# EasyEDA Pro project WorkshopEth.eprj

# Schematic WorkshopEth
Board Name: WorkshopEth; Create Date: 2024-12-09; Page Name: WorkshopEth; Project Name: WorkshopEth; Schematic Name: WorkshopEth; Update Date: 2024-12-20; Company: EasyEDA.com; Drawn: EasyEDA; Page Size: A4; Part Number: JLCPCB-002; Reviewed: EasyEDA; Version: V0.1
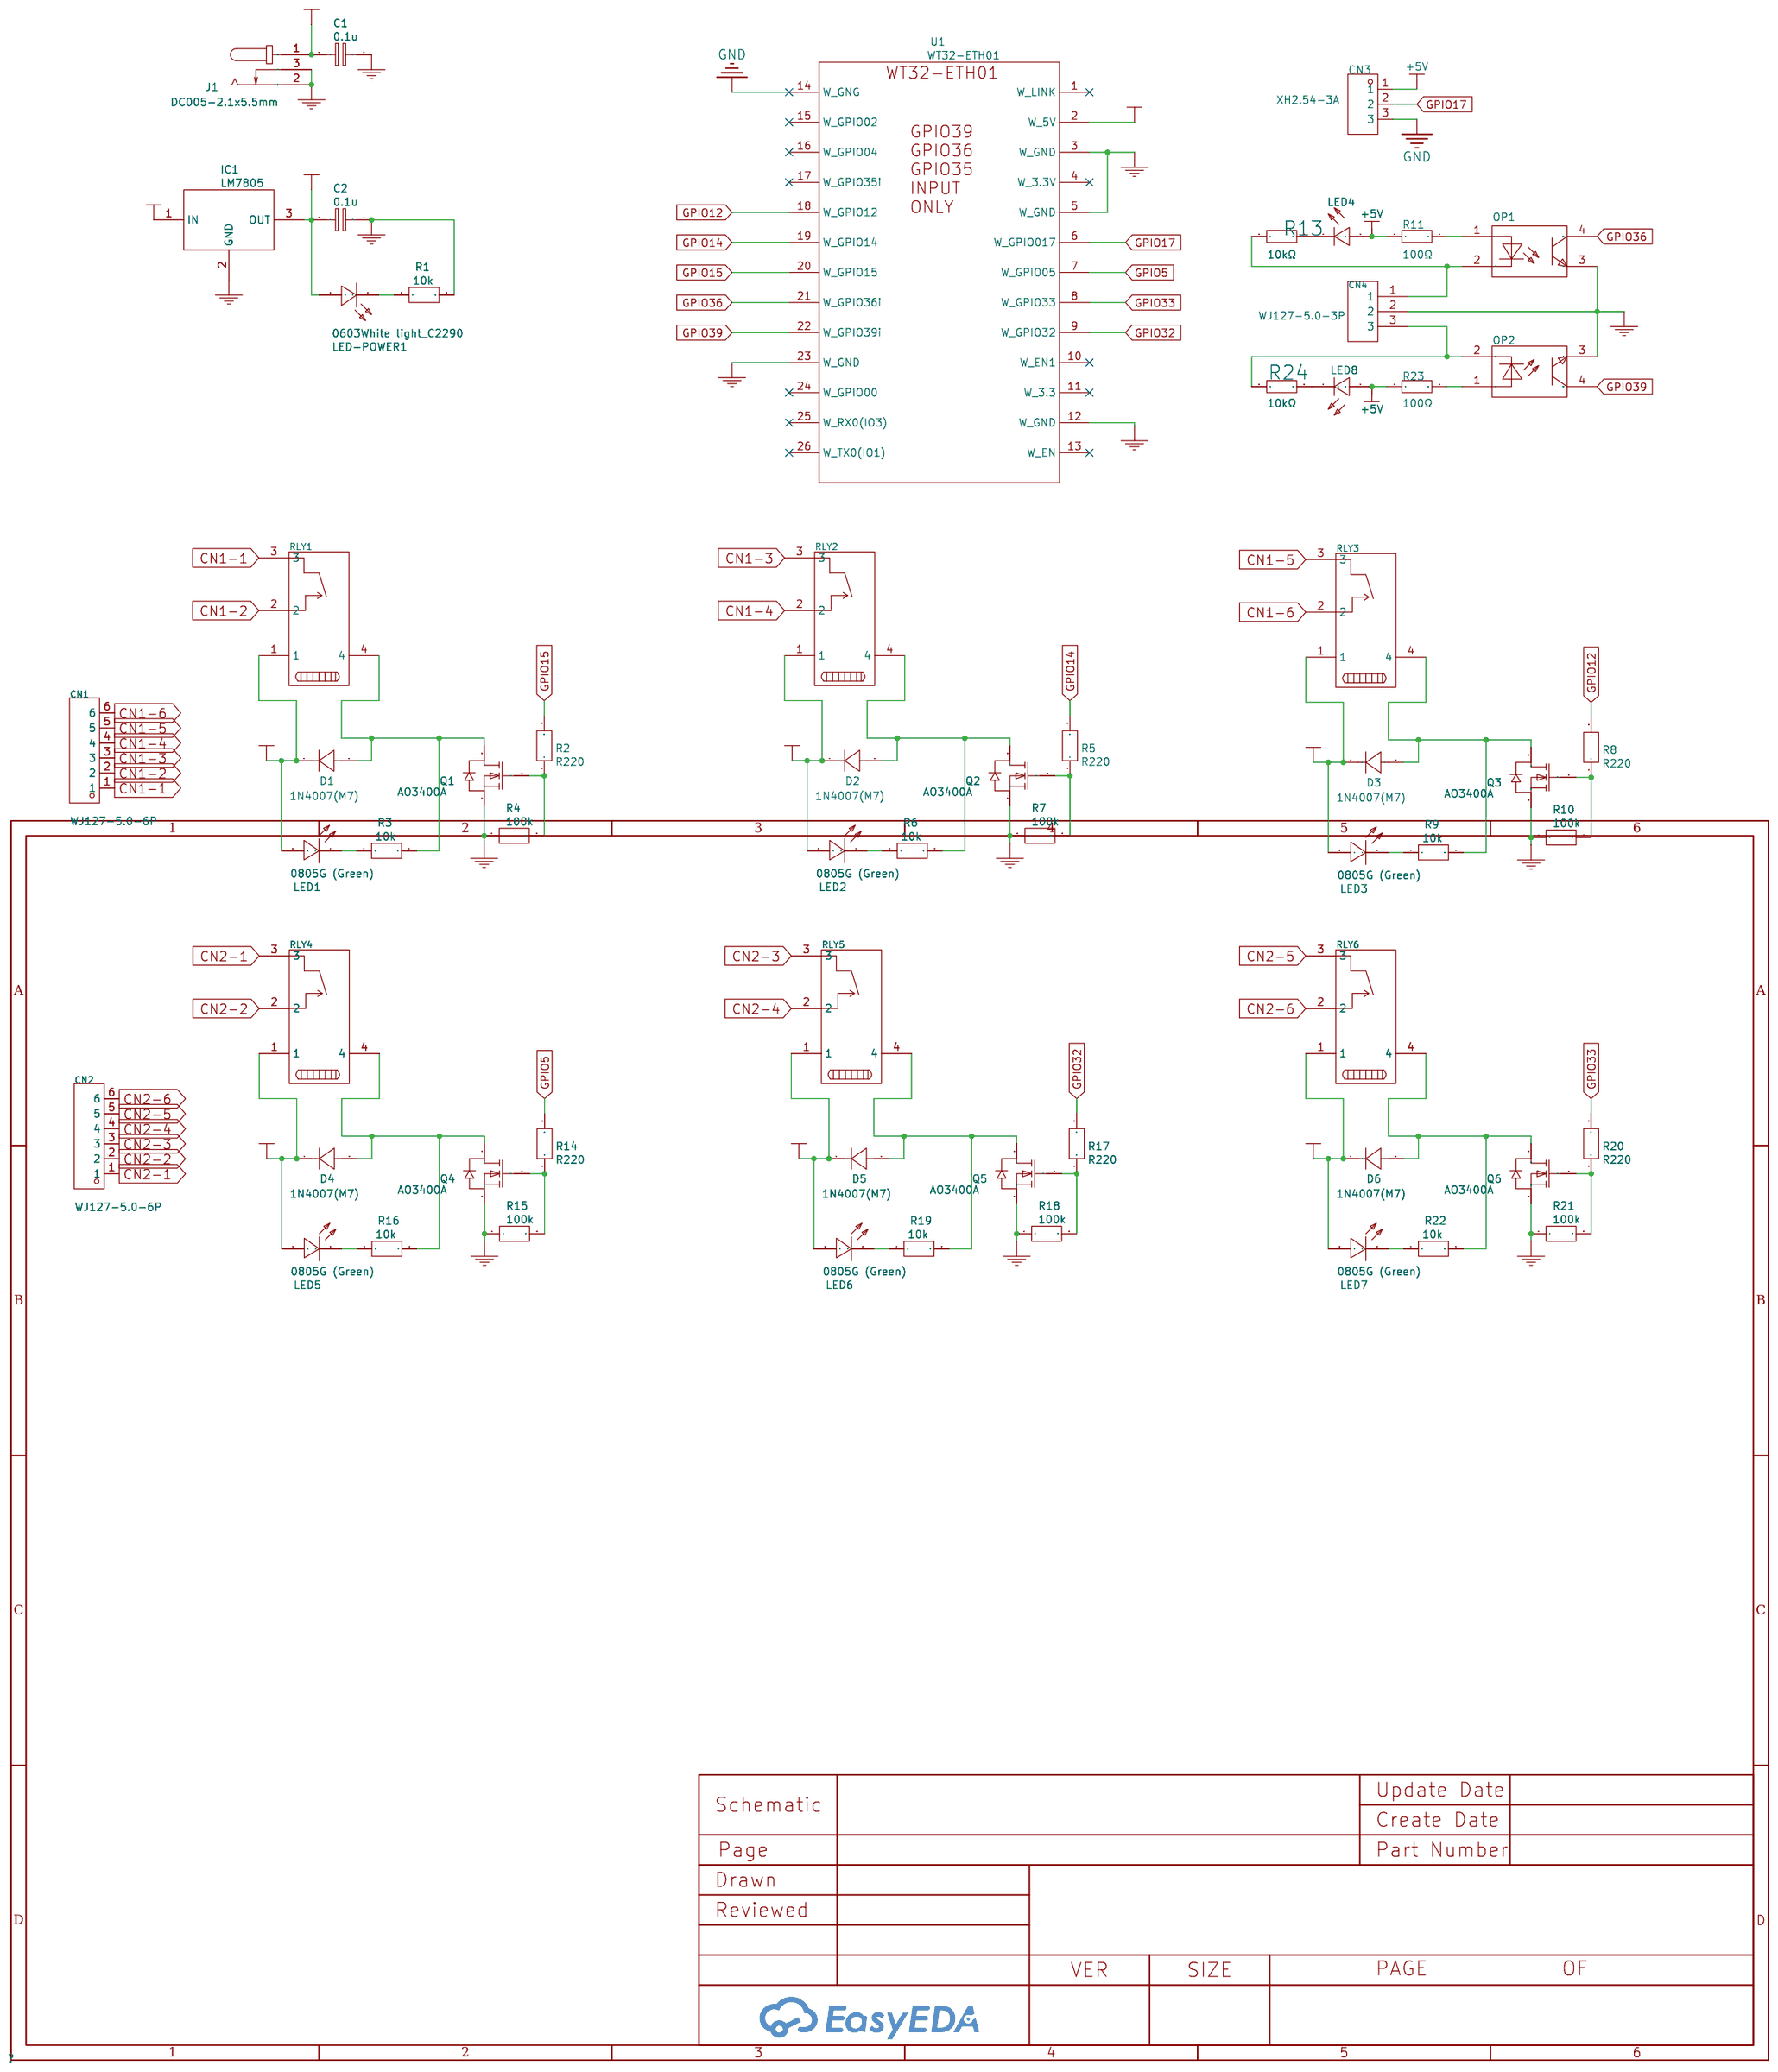
[diagram p0: schematic sheet]

## Parts
C1  0.1u  [C0603]
C2  0.1u  [C0603]
CN1  WJ127-5.0-6P  [CONN-TH_6P-P5.00_WJ127-5.0-6P]  (no BOM)
CN2  WJ127-5.0-6P  [CONN-TH_6P-P5.00_WJ127-5.0-6P]  (no BOM)
CN3  XH2.54-3A  [CONN-TH_3P-P2.50_HCTL_XH-3A-L]  (no BOM)
CN4  WJ127-5.0-3P  [CONN-TH_3P-P5.00_WJ127-5.0-3P]  (no BOM)
D1  1N4007(M7)  [SMA_L4.3-W2.7-LS5.1-RD]
D2  1N4007(M7)  [SMA_L4.3-W2.7-LS5.1-RD]
D3  1N4007(M7)  [SMA_L4.3-W2.7-LS5.1-RD]
D4  1N4007(M7)  [SMA_L4.3-W2.7-LS5.1-RD]
D5  1N4007(M7)  [SMA_L4.3-W2.7-LS5.1-RD]
D6  1N4007(M7)  [SMA_L4.3-W2.7-LS5.1-RD]
IC1  LM7805  [LM7805]  (no BOM)
J1  DC005-2.1x5.5mm  [DC-IN-TH_POWER-JACK]  (no BOM)
LED1  0805G (Green)  [LED0805-RD_GREEN]
LED2  0805G (Green)  [LED0805-RD_GREEN]
LED3  0805G (Green)  [LED0805-RD_GREEN]
LED4  19-213/Y2C-CQ2R2L/3T(CY)  [LED0603-RD-YELLOW]
LED5  0805G (Green)  [LED0805-RD_GREEN]
LED6  0805G (Green)  [LED0805-RD_GREEN]
LED7  0805G (Green)  [LED0805-RD_GREEN]
LED8  19-213/Y2C-CQ2R2L/3T(CY)  [LED0603-RD-YELLOW]
LED-POWER1  0603White light_C2290  [LED0603-R-RD_WHITE]
OP1  EL817S1(C)(TU)-F  [OPTO-SMD-4_L4.6-W6.5-P2.54-LS10.3-TL]
OP2  EL817S1(C)(TU)-F  [OPTO-SMD-4_L4.6-W6.5-P2.54-LS10.3-TL]
Q1  AO3400A  [SOT-23-3_L2.9-W1.6-P1.90-LS2.8-BR]
Q2  AO3400A  [SOT-23-3_L2.9-W1.6-P1.90-LS2.8-BR]
Q3  AO3400A  [SOT-23-3_L2.9-W1.6-P1.90-LS2.8-BR]
Q4  AO3400A  [SOT-23-3_L2.9-W1.6-P1.90-LS2.8-BR]
Q5  AO3400A  [SOT-23-3_L2.9-W1.6-P1.90-LS2.8-BR]
Q6  AO3400A  [SOT-23-3_L2.9-W1.6-P1.90-LS2.8-BR]
R1  10k  [R0603]
R2  R220  [R0603]
R3  10k  [R0603]
R4  100k  [R0603]
R5  R220  [R0603]
R6  10k  [R0603]
R7  100k  [R0603]
R8  R220  [R0603]
R9  10k  [R0603]
R10  100k  [R0603]
R11  100Ω  [R0805]
R13  10kΩ  [R0603]
R14  R220  [R0603]
R15  100k  [R0603]
R16  10k  [R0603]
R17  R220  [R0603]
R18  100k  [R0603]
R19  10k  [R0603]
R20  R220  [R0603]
R21  100k  [R0603]
R22  10k  [R0603]
R23  100Ω  [R0805]
R24  10kΩ  [R0603]
RLY1  G5NB-1A-E-DC5V  [RELAY-TH_G5NB-1A-E-DCXX]  (no BOM)
RLY2  G5NB-1A-E-DC5V  [RELAY-TH_G5NB-1A-E-DCXX]  (no BOM)
RLY3  G5NB-1A-E-DC5V  [RELAY-TH_G5NB-1A-E-DCXX]  (no BOM)
RLY4  G5NB-1A-E-DC5V  [RELAY-TH_G5NB-1A-E-DCXX]  (no BOM)
RLY5  G5NB-1A-E-DC5V  [RELAY-TH_G5NB-1A-E-DCXX]  (no BOM)
RLY6  G5NB-1A-E-DC5V  [RELAY-TH_G5NB-1A-E-DCXX]  (no BOM)
U1  WT32-ETH01  [WT32-ETH01-M]  (no BOM)

## Library data of the parts
C1 C2 = 0.1u: Supplier Part: C1525; Supplier: LCSC; Manufacturer Part: CL05B104KO5NNNC; Manufacturer: SAMSUNG(三星)
CN1 CN2 = WJ127-5.0-6P: LCSC Part Name: 5mm 1x6P 排数:1 每排P数:6 直插; Supplier Part: C192781; Manufacturer: KANGNEX(康奈克斯电气); Supplier Footprint: 插件,P=5mm; JLCPCB Part Class: Extended Part; Datasheet: https://atta.szlcsc.com/upload/public/pdf/source/20191225/C192781_B56A6C480C3F3CBA75DCAA22912D9BEF.pdf; Supplier: LCSC; Structure: 1x6P; Pitch: 5mm; Color: Green; Mounting Style: Straight; Current Rating (Max): 15A; Voltage Rating (Max): 250V; Number of Pins: 6P; Number of Rows: 1; Wire Gauge - AWG: 14~26; Wire Gauge - mm2: 1.5; Number of PINs Per Row: 6; Operating Temperature Range: -40℃~+105℃
CN3 = XH2.54-3A: Supplier Part: C9900018379; Supplier: LCSC
CN4 = WJ127-5.0-3P: LCSC Part Name: 5mm 1x3P 排数:1 每排P数:3 直插; Supplier Part: C8393; Manufacturer: KANGNEX(康奈克斯电气); Supplier Footprint: 插件,P=5mm; JLCPCB Part Class: Extended Part; Datasheet: https://atta.szlcsc.com/upload/public/pdf/source/20191225/C8393_D72692E3E43042C26B9E7345DD336F60.pdf; Supplier: LCSC; Structure: 1x3P; Pitch: 5mm; Color: Green; Mounting Style: Straight; Current Rating (Max): 15A; Voltage Rating (Max): 250V; Number of Pins: 3P; Number of Rows: 1; Wire Gauge - AWG: 14~26; Wire Gauge - mm2: 1.5; Number of PINs Per Row: 3; Operating Temperature Range: -40℃~+105℃
D1-D6 = 1N4007(M7): Supplier: LCSC; Supplier Part: C2988638; Manufacturer: UMW(友台半导体); JLCPCB Part Class: Extended Part
IC1 = LM7805: sim: true
J1 = DC005-2.1x5.5mm: Supplier: LCSC; Supplier Part: C9900001795; Manufacturer: 索峰; Manufacturer Part: POWER-JACK; JLCPCB Part Class: Extended Part
LED1-LED3 LED5-LED7 = 0805G (Green): Supplier: LCSC; Manufacturer: KENTO; Supplier Part: C2297; JLCPCB Part Class: Basic Part
LED4 LED8 = 19-213/Y2C-CQ2R2L/3T(CY): LCSC Part Name: 黄灯; Supplier Part: C72038; Manufacturer: EVERLIGHT(亿光); Supplier Footprint: 0603; JLCPCB Part Class: Basic Part; Datasheet: https://atta.szlcsc.com/upload/public/pdf/source/20160507/1462613613586.pdf; Supplier: LCSC; Emitted Color: Yellow; Power Dissipation: 60mW; Forward Current: 20mA; Dominant Wavelength: 585.5nm~591.5nm; Peak Wavelength: 591nm; Lens Color: 无色透明透镜; Viewing Angle: 120°; Operating Temperature: -40℃~+85℃
LED-POWER1 = 0603White light_C2290: Supplier: LCSC; Manufacturer: KENTO; Manufacturer Part: KT-0603W; Supplier Part: C2290; JLCPCB Part Class: Basic Part
OP1 OP2 = EL817S1(C)(TU)-F: Supplier: LCSC; Manufacturer: EVERLIGHT(亿光); Supplier Part: C106900; JLCPCB Part Class: Basic Part
Q1-Q6 = AO3400A: Supplier: LCSC; Manufacturer: AOS; Supplier Part: C20917; JLCPCB Part Class: Basic Part
R1 R3 R6 R9 R16 R19 R22 = 10k: Supplier Part: C25804; Supplier: LCSC; Manufacturer Part: 0603WAF1002T5E; Manufacturer: UNI-ROYAL(厚声)
R2 R5 R8 R14 R17 R20 = R220: Supplier Part: C22962; Supplier: LCSC; Manufacturer Part: 0603WAF2200T5E; Manufacturer: UNI-ROYAL(厚声)
R4 R7 R10 R15 R18 R21 = 100k: Supplier Part: C25803; Supplier: LCSC; Manufacturer Part: 0603WAF1003T5E; Manufacturer: UNI-ROYAL(厚声)
R11 R23 = 0805W8F1000T5E_C17408: LCSC Part Name: 100Ω ±1% 125mW 厚膜电阻; Supplier Part: C17408; Manufacturer: UNI-ROYAL(厚声); Manufacturer Part: 0805W8F1000T5E; Supplier Footprint: 0805; JLCPCB Part Class: Basic Part; Datasheet: https://atta.szlcsc.com/upload/public/pdf/source/20200306/C422600_1E6D84923E4A46A82E41ADD87F860B5C.pdf; Supplier: LCSC; Type: Thick Film Resistors; Tolerance: ±1%; Temperature Coefficient: ±100ppm/℃; Operating Temperature Range: -55℃~+155℃
R13 R24 = 0603WAF1002T5E: LCSC Part Name: 厚膜电阻 10kΩ ±1% 100mW; Supplier Part: C25804; Manufacturer: UNI-ROYAL(厚声); Supplier Footprint: 0603; JLCPCB Part Class: Basic Part; Datasheet: https://atta.szlcsc.com/upload/public/pdf/source/20200306/C422600_1E6D84923E4A46A82E41ADD87F860B5C.pdf; Supplier: LCSC; Type: Thick Film Resistors; Tolerance: ±1%; Temperature Coefficient: ±100ppm/℃; Operating Temperature Range: -55℃~+155℃
RLY1-RLY6 = G5NB-1A-E-DC5V: Supplier Part: C48746; Manufacturer: OMRON(欧姆龙); Supplier Footprint: 插件,7x20.4mm; JLCPCB Part Class: Extended Part; Supplier: LCSC
U1 = WT32-ETH01: Manufacturer: Wireless-Tag; link: http://www.wireless-tag.com/wp-content/uploads/2020/08/WT32-ETH01规格书V1.2EN（英文）.pdf

## Nets
+5V: C2.1 CN3.1 D1.1(K) D2.1(K) D3.1(K) D4.1(K) D5.1(K) D6.1(K) IC1.3(OUT) LED1.2(A) LED2.2(A) LED3.2(A) LED4.2(A) LED5.2(A) LED6.2(A) LED7.2(A) LED8.2(A) LED-POWER1.1(A) R11.1 R23.1 RLY1.1 RLY2.1 RLY3.1 RLY4.1 RLY5.1 RLY6.1 U1.2(W_5V)
GND: C1.2 C2.2 CN3.3 CN4.2 IC1.2(GND) J1.2(GND) J1.3 OP1.3(EM) OP2.3(EM) Q1.2(S) Q2.2(S) Q3.2(S) Q4.2(S) Q5.2(S) Q6.2(S) R1.2 R4.1 R7.1 R10.1 R15.1 R18.1 R21.1 U1.3(W_GND) U1.5(W_GND) U1.12(W_GND) U1.14(W_GNG) U1.23(W_GND)
VCC: C1.1 IC1.1(IN) J1.1(VCC)
CN1-1: CN1.1 RLY1.3
CN1-2: CN1.2 RLY1.2
CN1-3: CN1.3 RLY2.3
CN1-4: CN1.4 RLY2.2
CN1-5: CN1.5 RLY3.3
CN1-6: CN1.6 RLY3.2
CN2-1: CN2.1 RLY4.3
CN2-2: CN2.2 RLY4.2
CN2-3: CN2.3 RLY5.3
CN2-4: CN2.4 RLY5.2
CN2-5: CN2.5 RLY6.3
CN2-6: CN2.6 RLY6.2
GPIO5: R14.2 U1.7(W_GPIO05)
GPIO12: R8.2 U1.18(W_GPIO12)
GPIO14: R5.2 U1.19(W_GPIO14)
GPIO15: R2.2 U1.20(W_GPIO15)
GPIO17: CN3.2 U1.6(W_GPIO017)
GPIO32: R17.2 U1.9(W_GPIO32)
GPIO33: R20.2 U1.8(W_GPIO33)
GPIO36: OP1.4(COL) U1.21(W_GPIO36i)
GPIO39: OP2.4(COL) U1.22(W_GPIO39i)
$1N3: D1.2(A) Q1.3(D) R3.2 RLY1.4
$1N5: Q1.1(G) R2.1 R4.2
$1N15: LED1.1(K) R3.1
$1N16: LED-POWER1.2(K) R1.1
$1N14239: D2.2(A) Q2.3(D) R6.2 RLY2.4
$1N14251: LED2.1(K) R6.1
$1N14257: Q2.1(G) R5.1 R7.2
$1N14805: D3.2(A) Q3.3(D) R9.2 RLY3.4
$1N14817: LED3.1(K) R9.1
$1N14823: Q3.1(G) R8.1 R10.2
$1N15278: OP1.1(AN) R11.2
$1N15297: CN4.1 OP1.2(CAT) R13.1
$1N21025: LED4.1(C) R13.2
$1N23793: D4.2(A) Q4.3(D) R16.2 RLY4.4
$1N23794: Q4.1(G) R14.1 R15.2
$1N23798: LED5.1(K) R16.1
$1N24302: D5.2(A) Q5.3(D) R19.2 RLY5.4
$1N24303: Q5.1(G) R17.1 R18.2
$1N24307: LED6.1(K) R19.1
$1N24310: D6.2(A) Q6.3(D) R22.2 RLY6.4
$1N24311: Q6.1(G) R20.1 R21.2
$1N24315: LED7.1(K) R22.1
$1N26257: OP2.1(AN) R23.2
$1N26258: CN4.3 OP2.2(CAT) R24.1
$1N26259: LED8.1(C) R24.2

Not connected (* = marked no-connect by the designer): U1 1(W_LINK)* 4(W_3.3V)* 10(W_EN1)* 11(W_3.3)* 13(W_EN)* 15(W_GPIO02)* 16(W_GPIO04)* 17(W_GPIO35i)* 24(W_GPIO00)* 25(W_RX0(IO3))* 26(W_TX0(IO1))*

# Board WorkshopEth
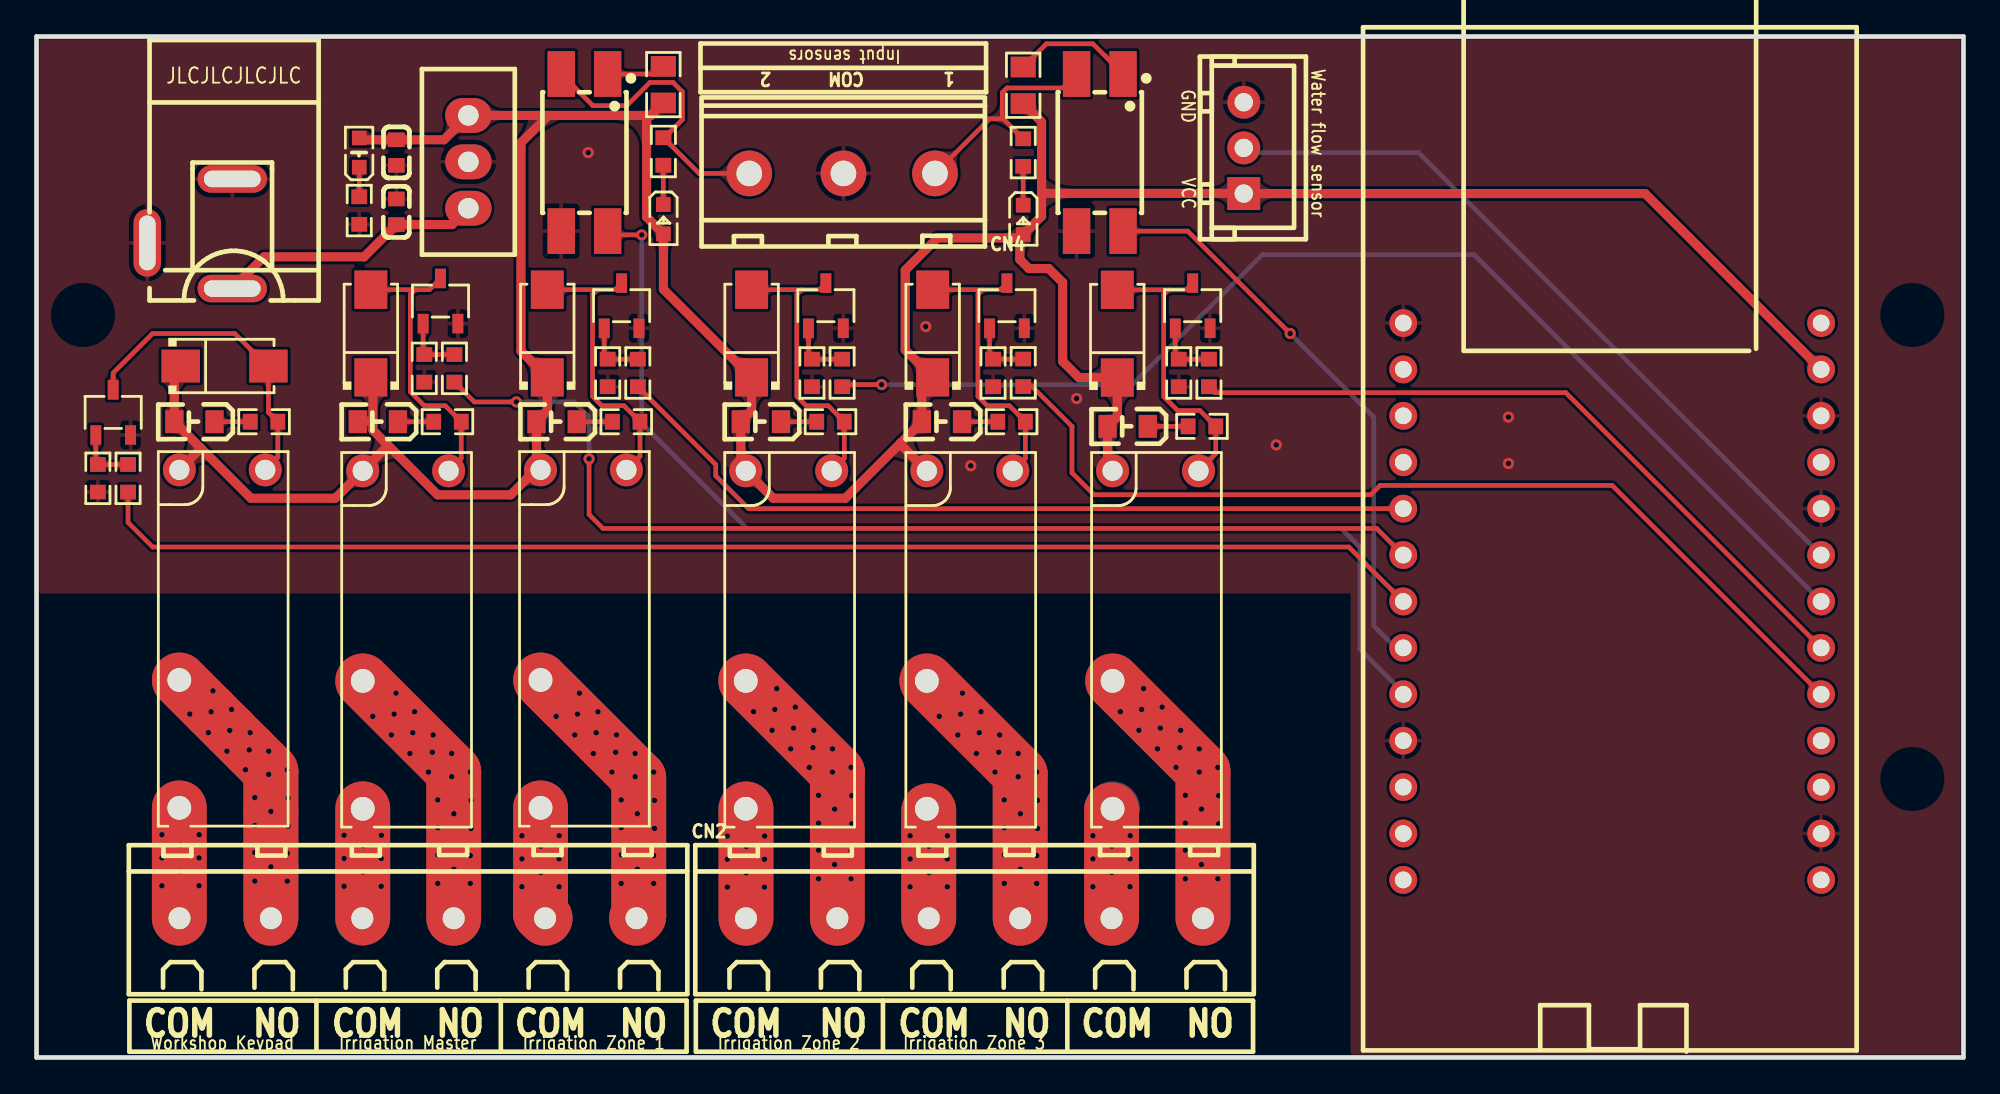
[diagram p1: board, top side]
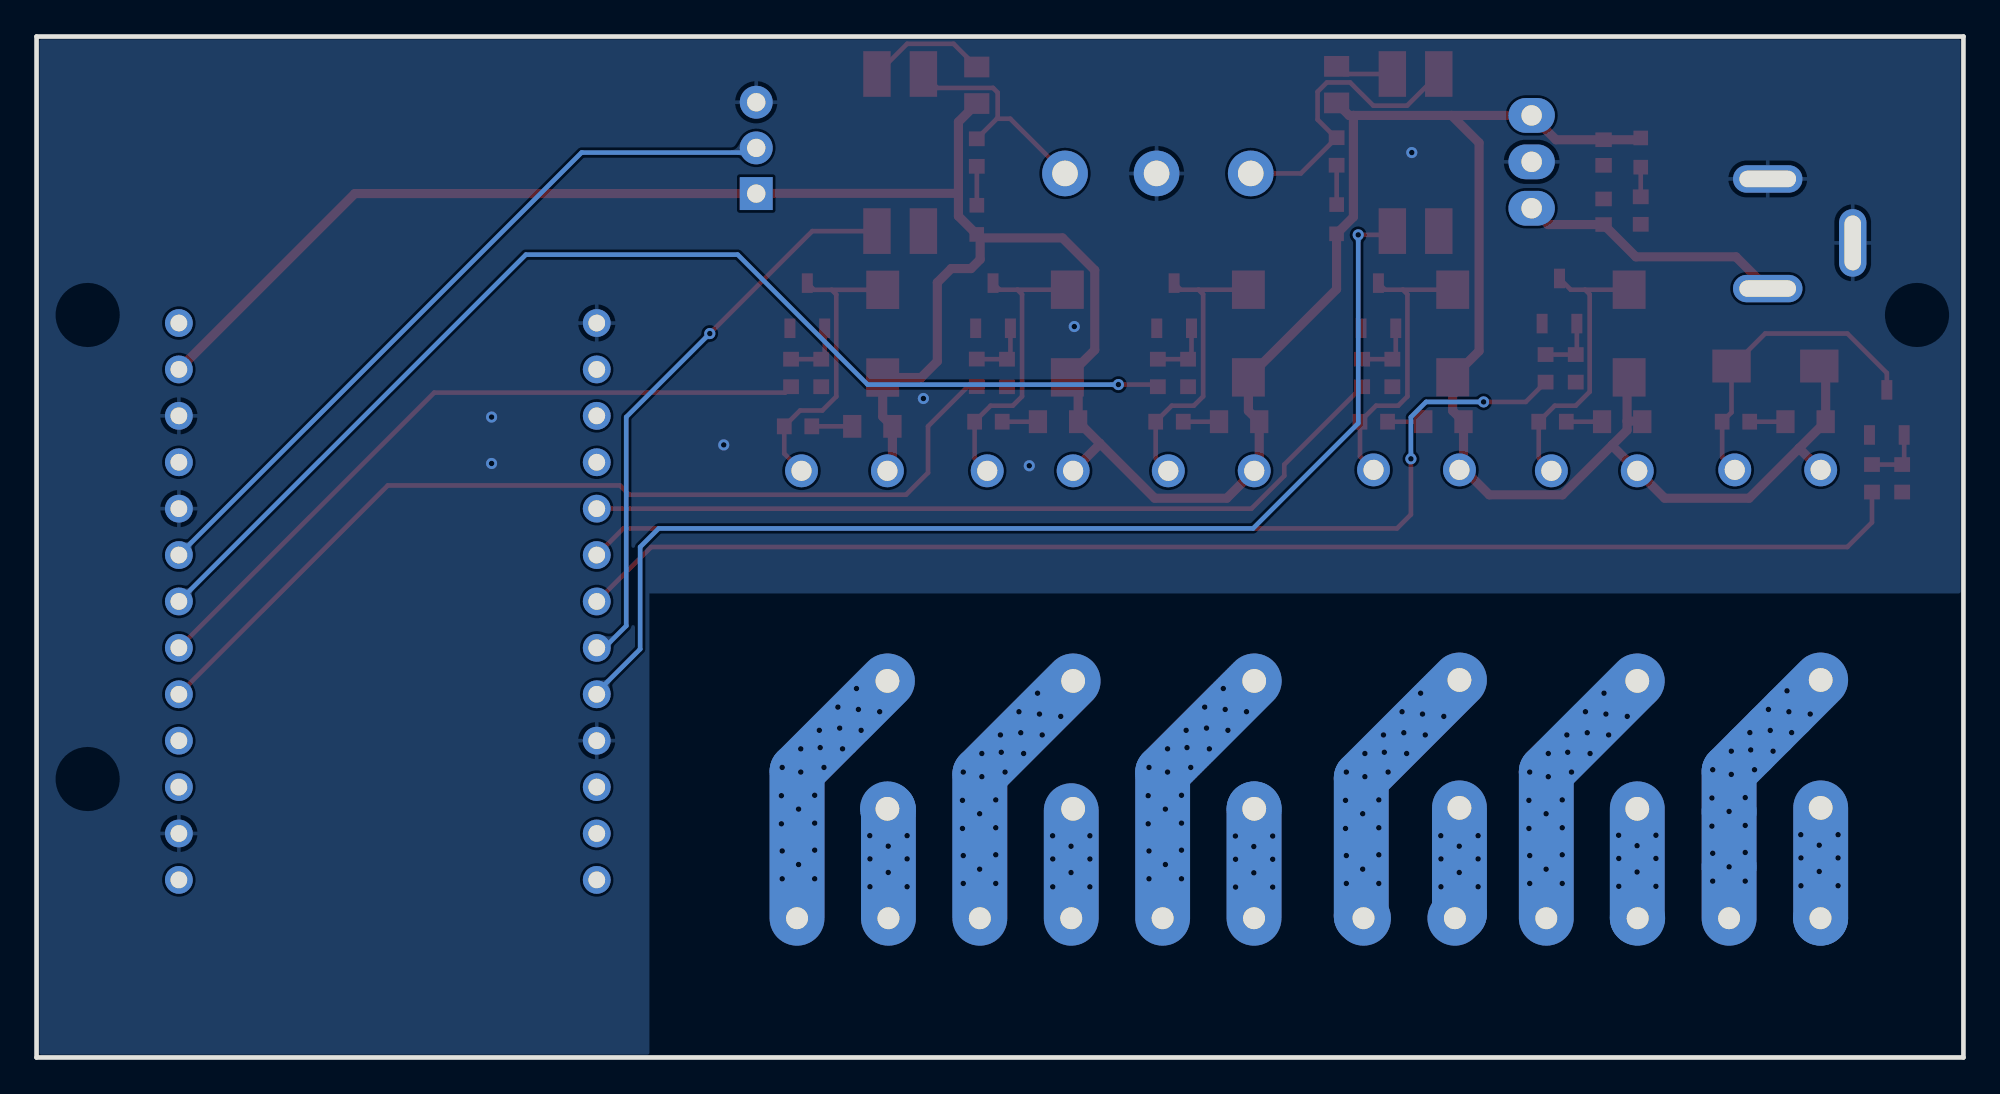
[diagram p2: board, bottom side, seen from below]

Outline 105.41 x 55.88 mm; copper layers: Top Layer, Bottom Layer. Coordinates in mm from the lower left corner of the outline.
Outline path: 0,55.88 105.41,55.88 105.41,0 0,0 0,55.88
Stack: Top Layer 0.035mm / Dielectric1 1.51mm FR4 er 4.5 / Bottom Layer 0.035mm

## Design rules (mm)
template: User Custom Config
spacing Default (default): track to track 0.152, other pairs 0 to 0.152
track width Default (default): min 0.254, default 0.254, max 25.4
track width 0.5mm: min 0.5, default 0.5, max 2.54
differential pair differentialPair (default): width min 0.127, default 0.254, max 2.54; gap min 0.152, default 0.152
via Default (default): diameter min 0.61, default 0.61, max 100.025; hole min 0.305, default 0.305, max 59.995
net +5V uses 0.5mm
net VCC uses 0.5mm

## Placement (name value [footprint] x y rotation side)
C1  0.1u  [C0603]  19.69 46.29 90 top
C2  0.1u  [C0603]  19.69 49.53 270 top
CN1  WJ127-5.0-6P  [CONN-TH_6P-P5.00_WJ127-5.0-6P]  20.32 7.62 0 top
CN2  WJ127-5.0-6P  [CONN-TH_6P-P5.00_WJ127-5.0-6P]  51.31 7.62 0 top
CN3  XH2.54-3A  [CONN-TH_3P-P2.50_HCTL_XH-3A-L]  66.04 49.78 270 top
CN4  WJ127-5.0-3P  [CONN-TH_3P-P5.00_WJ127-5.0-3P]  44.07 48.39 180 top
D1  1N4007(M7)  [SMA_L4.3-W2.7-LS5.1-RD]  10.29 37.85 0 top
D2  1N4007(M7)  [SMA_L4.3-W2.7-LS5.1-RD]  18.29 39.62 90 top
D3  1N4007(M7)  [SMA_L4.3-W2.7-LS5.1-RD]  27.94 39.62 90 top
D4  1N4007(M7)  [SMA_L4.3-W2.7-LS5.1-RD]  39.12 39.62 90 top
D5  1N4007(M7)  [SMA_L4.3-W2.7-LS5.1-RD]  49.02 39.62 90 top
D6  1N4007(M7)  [SMA_L4.3-W2.7-LS5.1-RD]  59.12 39.62 90 top
IC1  -  [LM7805]  23.62 49.02 90 top
J1  DC005-2.1x5.5mm  [DC-IN-TH_POWER-JACK]  8.38 45.08 270 top
LED1  0805G (Green)  [LED0805-RD_GREEN]  8.64 34.8 0 top
LED2  0805G (Green)  [LED0805-RD_GREEN]  18.67 34.8 0 top
LED3  0805G (Green)  [LED0805-RD_GREEN]  28.45 34.8 0 top
LED4  19-213/Y2C-CQ2R2L/3T(CY)  [LED0603-RD-YELLOW]  53.97 45.85 270 top
LED5  0805G (Green)  [LED0805-RD_GREEN]  39.62 34.8 0 top
LED6  0805G (Green)  [LED0805-RD_GREEN]  49.53 34.8 0 top
LED7  0805G (Green)  [LED0805-RD_GREEN]  59.69 34.54 0 top
LED8  19-213/Y2C-CQ2R2L/3T(CY)  [LED0603-RD-YELLOW]  34.29 45.88 270 top
LED-POWER1  0603White light_C2290  [LED0603-R-RD_WHITE]  17.65 49.53 90 top
OP1  EL817S1(C)(TU)-F  [OPTO-SMD-4_L4.6-W6.5-P2.54-LS10.3-TL]  58.17 49.53 270 top
OP2  EL817S1(C)(TU)-F  [OPTO-SMD-4_L4.6-W6.5-P2.54-LS10.3-TL]  29.97 49.53 270 top
Q1  AO3400A  [SOT-23-3_L2.9-W1.6-P1.90-LS2.8-BR]  4.19 35.31 90 top
Q2  AO3400A  [SOT-23-3_L2.9-W1.6-P1.90-LS2.8-BR]  22.1 41.4 90 top
Q3  AO3400A  [SOT-23-3_L2.9-W1.6-P1.90-LS2.8-BR]  32 41.15 90 top
Q4  AO3400A  [SOT-23-3_L2.9-W1.6-P1.90-LS2.8-BR]  43.18 41.15 90 top
Q5  AO3400A  [SOT-23-3_L2.9-W1.6-P1.90-LS2.8-BR]  53.09 41.15 90 top
Q6  AO3400A  [SOT-23-3_L2.9-W1.6-P1.90-LS2.8-BR]  63.25 41.15 90 top
R1  10k  [R0603]  17.65 46.36 270 top
R2  R220  [R0603]  5 31.7 270 top
R3  10k  [R0603]  12.45 34.8 0 top
R4  100k  [R0603]  3.35 31.7 90 top
R5  R220  [R0603]  22.86 37.72 270 top
R6  10k  [R0603]  22.48 34.8 0 top
R7  100k  [R0603]  21.21 37.72 90 top
R8  R220  [R0603]  32.89 37.47 270 top
R9  10k  [R0603]  32.26 34.8 0 top
R10  100k  [R0603]  31.24 37.47 90 top
R11  100Ω  [R0805]  53.97 53.21 90 top
R13  10kΩ  [R0603]  53.97 49.53 270 top
R14  R220  [R0603]  44.07 37.47 270 top
R15  100k  [R0603]  42.42 37.47 90 top
R16  10k  [R0603]  43.43 34.8 0 top
R17  R220  [R0603]  53.97 37.47 270 top
R18  100k  [R0603]  52.32 37.47 90 top
R19  10k  [R0603]  53.34 34.8 0 top
R20  R220  [R0603]  64.13 37.47 270 top
R21  100k  [R0603]  62.48 37.47 90 top
R22  10k  [R0603]  63.75 34.54 0 top
R23  100Ω  [R0805]  34.29 53.25 90 top
R24  10kΩ  [R0603]  34.29 49.59 270 top
RLY1  G5NB-1A-E-DC5V  [RELAY-TH_G5NB-1A-E-DCXX]  10.16 22.91 270 top
RLY2  G5NB-1A-E-DC5V  [RELAY-TH_G5NB-1A-E-DCXX]  20.19 22.86 270 top
RLY3  G5NB-1A-E-DC5V  [RELAY-TH_G5NB-1A-E-DCXX]  29.92 22.91 270 top
RLY4  G5NB-1A-E-DC5V  [RELAY-TH_G5NB-1A-E-DCXX]  41.15 22.86 270 top
RLY5  G5NB-1A-E-DC5V  [RELAY-TH_G5NB-1A-E-DCXX]  51.05 22.86 270 top
RLY6  G5NB-1A-E-DC5V  [RELAY-TH_G5NB-1A-E-DCXX]  61.21 22.86 270 top
U1  WT32-ETH01  [WT32-ETH01-M]  85.6 26.67 270 top

## Footprints (pads in the part's own frame, mm; a bottom-side part is the same pattern mirrored in y, then rotated)
C0603
  rect 0.8x0.9 smd: 1(-0.7,0) 2(0.7,0)
CONN-TH_3P-P2.50_HCTL_XH-3A-L
  rect 1.8x1.8 hole 1: 1(2.5,0)
  round 1.8 hole 1: 2(0,0) 3(-2.5,0)
CONN-TH_3P-P5.00_WJ127-5.0-3P
  round 2.5 hole 1.4: 1(-5.08,0) 2(-0.071,0) 3(5.08,0)
CONN-TH_6P-P5.00_WJ127-5.0-6P
  round 2.5 hole 1.2: 1(-12.5,0) 2(-7.5,0) 3(-2.5,0) 4(2.5,0) 5(7.5,0) 6(12.5,0)
DC-IN-TH_POWER-JACK
  oval 1.5x3.8 hole 0.9x3.1: 1(3,2.325) 2(-2.999,2.325)
  oval 3.7x1.5 hole 3x0.9: 3(0.5,-2.325)
LED0603-R-RD_WHITE
  rect 0.8x0.8 smd: 1(0.8,0) 2(-0.8,0)
LED0603-RD-YELLOW
  rect 0.8x0.8 smd: 1(-0.799,-0.004) 2(0.799,0.004)
LED0805-RD_GREEN
  rect 1x1.25 smd: 1(1.1,0) 2(-1.099,0)
LM7805
  oval 1.905x2.54 hole 1.117: 1(-2.54,0) 2(0,0) 3(2.54,0)
OPTO-SMD-4_L4.6-W6.5-P2.54-LS10.3-TL
  rect 2.5x1.5 smd: 1(-4.3,1.27) 2(-4.3,-1.27) 3(4.3,-1.27) 4(4.3,1.27)
R0603
  rect 0.806x0.864 smd: 1(-0.753,0) 2(0.753,0)
R0805
  rect 1.133x1.377 smd: 1(-1,0) 2(1,0)
RELAY-TH_G5NB-1A-E-DCXX
  round 1.8 hole 1.1: 1(-9.25,-2.35) 4(-9.25,2.35)
  round 2 hole 1.3: 2(2.25,-2.35) 3(9.25,-2.35)
SMA_L4.3-W2.7-LS5.1-RD
  rect 2.1x1.8 smd: 1(-2.4,0) 2(2.4,0)
SOT-23-3_L2.9-W1.6-P1.90-LS2.8-BR
  rect 1.07x0.6 smd: 1(-1.235,0.95) 2(-1.235,-0.95) 3(1.236,0)
WT32-ETH01-M
  round 1.524 hole 0.914: 1(-13.529,12.027) 2(-10.989,12.027) 3(-8.449,12.027) 4(-5.909,12.027) 5(-3.369,12.027) 6(-0.829,12.027) 7(1.711,12.027) 8(4.251,12.027) 9(6.791,12.027) 10(9.331,12.027) 11(11.871,12.027) 12(14.411,12.027) 13(16.951,12.027) 14(-13.529,-10.833) 15(-10.989,-10.833) 16(-8.449,-10.833) 17(-5.909,-10.833) 18(-3.369,-10.833) 19(-0.829,-10.833) 20(1.711,-10.833) 21(4.251,-10.833) 22(6.791,-10.833) 23(9.331,-10.833) 24(11.871,-10.833) 25(14.411,-10.833) 26(16.951,-10.833)

## Nets
As in the schematic.

Pads without a net: U1 1 4 10 11 13 15 16 17 24 25 26

## Via types
v1: diameter 0.61, hole 0.305, Top Layer to Bottom Layer, 198 vias

## Routing (per net, layer and track width the routed paths; a pad name or vN(x,y) marks a point on that pad's centre or on a via; arc(x,y) is an arc through that point)
+5V: length 197.4
  Top Layer w0.5: 27.44,32.3 25.94,30.8 21.94,30.8 19.2,33.54 ; 27.44,32.3 RLY3.1 ; 27.44,32.3 27.35,32.38 LED3.2 27.94,35.39 D3.1 26.5,38.67 26.5,50.06 28,51.56 ; RLY1.1 8.98,33.33 8.98,33.35 ; 19.2,33.54 19.2,33.46 RLY2.1 16.34,30.61 11.72,30.61 8.98,33.35 ; 19.2,33.54 18.4,34.33 18.4,34.83 ; 53.79,44.86 53.79,43.68 54.29,43.18 55.37,43.18 56.13,42.42 56.13,38.1 57.02,37.22 D6.1 59.12,35.08 LED7.2 58.59,32.38 RLY6.1 ; 53.79,44.86 49.29,44.86 47.52,43.09 47.52,38.72 D5.1 48.43,36.63 LED6.2 47.25,33.61 ; 53.79,44.86 LED4.2 54.98,46.05 54.98,47.3 ; 28,51.56 IC1.3 22.29,50.23 C2.1 17.75,50.23 LED-POWER1.1 ; 28,51.56 33.37,51.56 ; R23.1 33.6,51.56 33.37,51.56 ; RLY5.1 47.25,33.57 47.25,33.61 ; 8.98,33.35 LED1.2 7.54,37.5 D1.1 ; LED2.2 17.6,34.83 18.4,34.83 ; 47.25,33.61 44.24,30.61 40.3,30.61 RLY4.1 38.52,32.38 LED5.2 39.12,35.39 D4.1 34.29,42.05 LED8.2 33.37,46 33.37,51.56 ; R11.1 54.98,51.21 54.98,47.3 ; U1.2 88,47.28 CN3.1 66.03,47.3 54.98,47.3 ; 18.4,34.83 18.4,37.11 D2.1
GND:
  vias: v1(30.18,49.53) v1(48.64,40) v1(51.1,32.39) v1(56.9,36.07) v1(67.82,33.53) v1(80.52,35.05) v1(80.52,32.51)
VCC: length 14.7
  Top Layer w0.5: J1.1 12.44,43.82 17.92,43.82 C1.1 22.73,45.59 IC1.1
CN1-1: length 12.1
  Top Layer w3: RLY1.3 7.81,7.63
  Bottom Layer w3: RLY1.3 7.81,7.63 CN1.1
  vias: v1(6.86,12.19) v1(6.86,10.92) v1(6.86,9.4) v1(7.89,11.62) v1(7.89,10.18) v1(8.9,12.19) v1(8.89,10.92) v1(8.89,9.4)
CN1-2: length 30.2
  Top Layer w3: CN1.2 v1(12.82,10.43) v1(12.82,13.47) 12.82,15.65 v1(11.64,16.83) v1(10.57,17.9) v1(9.55,18.92) RLY1.2
  Bottom Layer w3: RLY1.2 v1(9.55,18.92) v1(10.57,17.9) v1(11.64,16.83) 12.82,15.65 v1(12.82,13.47) v1(12.82,10.43) CN1.2
  vias: v1(8.38,18.8) v1(9.4,17.78) v1(9.65,20.07) v1(10.41,16.76) v1(10.67,19.05) v1(11.43,15.75) v1(11.68,17.78) v1(11.94,14.22) v1(11.94,12.7) v1(11.94,11.22) v1(11.94,9.65) v1(12.7,16.76) v1(12.7,15.49) v1(13.72,15.75) v1(13.72,11.18) v1(13.72,9.65) v1(13.76,14.2) v1(13.76,12.66)
CN1-3: length 12
  Top Layer w3: RLY2.3 17.84,7.64
  Bottom Layer w3: RLY2.3 17.84,7.64 CN1.3
  vias: v1(16.82,12.16) v1(16.82,10.89) v1(16.82,9.37) v1(17.85,11.59) v1(17.85,10.15) v1(18.86,12.16) v1(18.85,10.89) v1(18.85,9.37)
CN1-4: length 30.1
  Top Layer w3: RLY2.2 22.82,15.63 CN1.4
  Bottom Layer w3: CN1.4 22.82,15.63 RLY2.2
  vias: v1(18.39,18.67) v1(19.41,17.65) v1(19.56,18.8) v1(19.66,19.94) v1(20.42,16.64) v1(20.58,17.77) v1(20.68,18.92) v1(21.44,15.62) v1(21.65,16.71) v1(21.69,17.65) v1(21.95,14.1) v1(21.95,12.57) v1(21.95,11.09) v1(21.95,9.53) v1(22.71,16.64) v1(22.71,15.37) v1(22.83,13.34) v1(22.83,10.31) v1(23.73,15.62) v1(23.73,11.05) v1(23.73,9.53) v1(23.77,14.07) v1(23.77,12.53)
CN1-5: length 12.3
  Top Layer w3: CN1.5 27.57,7.87 RLY3.3
  Bottom Layer w3: CN1.5 27.57,7.87 RLY3.3
  vias: v1(26.55,12.14) v1(26.55,10.87) v1(26.55,9.34) v1(27.58,11.56) v1(27.58,10.12) v1(28.59,12.14) v1(28.58,10.87) v1(28.58,9.34)
CN1-6: length 30.6
  Top Layer w3: CN1.6 32.94,7.74 32.94,15.29 RLY3.2
  Bottom Layer w3: CN1.6 32.94,7.74 32.94,15.29 RLY3.2
  vias: v1(28.43,18.67) v1(29.44,17.65) v1(29.59,18.8) v1(29.7,19.94) v1(30.46,16.64) v1(30.61,17.77) v1(30.71,18.92) v1(31.47,15.62) v1(31.73,17.65) v1(31.68,16.71) v1(31.98,14.1) v1(31.98,12.57) v1(31.98,11.09) v1(31.98,9.53) v1(32.74,16.64) v1(32.74,15.37) v1(32.86,13.34) v1(32.86,10.31) v1(33.76,15.62) v1(33.8,14.07) v1(33.8,12.53) v1(33.76,11.05) v1(33.76,9.53)
CN2-1: length 12
  Top Layer w3: CN2.1 38.81,13.6
  Bottom Layer w3: CN2.1 38.81,13.6 RLY4.3
  vias: v1(37.79,12.12) v1(37.79,10.85) v1(37.79,9.33) v1(38.82,11.55) v1(38.82,10.11) v1(39.83,12.12) v1(39.82,10.85) v1(39.82,9.33)
CN2-2: length 30.1
  Top Layer w3: RLY4.2 43.81,15.6 CN2.2
  Bottom Layer w3: CN2.2 43.81,15.6 RLY4.2
  vias: v1(39.22,18.92) v1(40.24,17.91) v1(40.39,19.05) v1(40.49,20.19) v1(41.25,16.89) v1(41.41,18.03) v1(41.51,19.18) v1(42.27,15.88) v1(42.52,17.91) v1(42.48,16.96) v1(42.78,14.35) v1(42.78,12.83) v1(42.78,11.35) v1(42.78,9.78) v1(43.54,16.89) v1(43.54,15.62) v1(43.66,13.59) v1(43.66,10.56) v1(44.56,15.88) v1(44.6,14.33) v1(44.6,12.79) v1(44.56,11.3) v1(44.56,9.78)
CN2-3: length 11.8
  Top Layer w3: CN2.3 48.81,13.51
  Bottom Layer w3: CN2.3 48.81,13.51
  vias: v1(47.79,12.13) v1(47.79,10.86) v1(47.79,9.34) v1(48.82,11.56) v1(48.82,10.12) v1(49.83,12.13) v1(49.82,10.86) v1(49.82,9.34)
CN2-4: length 30.2
  Top Layer w3: CN2.4 53.81,15.51 RLY5.2
  Bottom Layer w3: CN2.4 53.81,15.51 RLY5.2
  vias: v1(49.38,18.67) v1(50.4,17.65) v1(50.55,18.8) v1(50.65,19.94) v1(51.41,16.64) v1(51.57,17.77) v1(51.67,18.92) v1(52.43,15.62) v1(52.64,16.71) v1(52.68,17.65) v1(52.94,14.1) v1(52.94,12.57) v1(52.94,11.09) v1(52.94,9.53) v1(53.7,16.64) v1(53.7,15.37) v1(53.82,13.34) v1(53.82,10.31) v1(54.72,15.62) v1(54.72,11.05) v1(54.72,9.53) v1(54.76,14.07) v1(54.76,12.53)
CN2-5: length 11.9
  Top Layer w3: CN2.5 58.81,13.55
  Bottom Layer w3: RLY6.3 58.81,13.55 CN2.5
  vias: v1(57.79,12.14) v1(57.79,10.87) v1(57.79,9.34) v1(58.82,11.57) v1(58.82,10.13) v1(59.83,12.14) v1(59.82,10.87) v1(59.82,9.34)
CN2-6: length 30.1
  Top Layer w3: CN2.6 63.81,15.67 RLY6.2
  Bottom Layer w3: RLY6.2 63.81,15.67 CN2.6
  vias: v1(59.29,18.92) v1(60.3,17.91) v1(60.45,19.05) v1(60.56,20.19) v1(61.32,16.89) v1(61.47,18.03) v1(61.57,19.18) v1(62.34,15.88) v1(62.54,16.96) v1(62.59,17.91) v1(62.84,14.35) v1(62.84,12.83) v1(62.84,11.35) v1(62.84,9.78) v1(63.6,16.89) v1(63.6,15.62) v1(63.72,13.59) v1(63.72,10.56) v1(64.62,15.88) v1(64.62,11.3) v1(64.62,9.78) v1(64.66,14.33) v1(64.66,12.79)
GPIO5: length 64.4
  Top Layer w0.254: R14.2 44.19,36.83 v1(46.23,36.83)
  Bottom Layer w0.254: U1.7 78.64,43.94 67.06,43.94 59.94,36.83 v1(46.23,36.83)
GPIO12: length 45
  Top Layer w0.254: 74.76,30.04 38.95,30.04 37.15,31.83 37.15,32.45 R8.2
GPIO14: length 59
  Top Layer w0.254: 74.76,27.5 73.31,28.96 30.99,28.96 30.23,29.72 v1(30.23,32.77) ; R5.2 23.94,35.88 v1(26.25,35.88)
  Bottom Layer w0.254: v1(30.23,32.77) 30.23,35.05 29.4,35.88 v1(26.25,35.88)
GPIO15: length 73.2
  Top Layer w0.254: R2.2 5,29.29 6.35,27.94 71.78,27.94 74.76,24.96
GPIO17: length 40.8
  Bottom Layer w0.254: CN3.2 66.29,49.53 75.59,49.53 U1.6
GPIO32: length 52.5
  Top Layer w0.254: R17.2 54.47,36.72 56.64,34.54 56.64,32 57.84,30.8 72.99,30.8 73.49,31.31 86.19,31.31 U1.9
GPIO33: length 39.4
  Top Layer w0.254: R20.2 64.46,36.39 83.65,36.39 U1.8
GPIO36: length 31.5
  Top Layer w0.254: OP1.4 62.97,45.23 v1(68.58,39.62)
  Bottom Layer w0.254: v1(68.58,39.62) 73.15,35.05 73.15,23.62 74.35,22.42 74.76,22.42
GPIO39: length 63.4
  Top Layer w0.254: OP2.4 31.45,45.03 v1(33.11,45.03)
  Bottom Layer w0.254: v1(33.11,45.03) 33.11,34.71 38.86,28.96 71.37,28.96 72.39,27.94 72.39,22.35 74.76,19.98 74.76,19.88
$1N3: length 17.3
  Top Layer w0.254: D1.2 12.69,37.78 ; 12.69,37.78 10.85,39.62 6.35,39.62 4.19,37.47 4.19,36.54 ; 12.69,37.78 12.69,35.31 R3.2 13.2,32.85 RLY1.4
$1N5: length 3.3
  Top Layer w0.254: R2.1 R4.2 3.24,32.56 Q1.1
$1N15: length 2
  Top Layer w0.254: LED1.1 R3.1
$1N16: length 1.6
  Top Layer w0.254: LED-POWER1.2 R1.1
$1N14239: length 16.2
  Top Layer w0.254: 20.7,42.02 21.48,42.02 22.1,42.64 ; 20.7,42.02 D2.2 ; 20.7,42.02 20.45,41.77 20.45,36.44 21.21,35.67 22.36,35.67 R6.2 23.23,32.8 22.54,32.11
$1N14251: length 2
  Top Layer w0.254: LED2.1 R6.1
$1N14257: length 3.4
  Top Layer w0.254: Q2.1 21.15,38.53 R7.2 R5.1
$1N14805: length 16.3
  Top Layer w0.254: D3.2 30.67,42.02 ; 30.67,42.02 31.65,42.02 Q3.3 ; 30.67,42.02 30.42,41.77 30.42,36.18 30.92,35.67 32.14,35.67 R9.2 33.01,32.9 RLY3.4
$1N14817: length 2
  Top Layer w0.254: LED3.1 R9.1
$1N14823: length 3.4
  Top Layer w0.254: R8.1 R10.2 31.05,38.41 Q3.1
$1N15278: length 6.7
  Top Layer w0.254: OP1.1 57.78,55.48 55.25,55.48 R11.2
$1N15297: length 12.5
  Top Layer w0.254: 52.88,51.38 52.83,51.43 52.83,52.81 53.09,53.07 56.13,53.07 OP1.2 ; 52.88,51.38 52.14,51.38 CN4.1 ; 52.88,51.38 R13.1
$1N21025: length 2.1
  Top Layer w0.254: LED4.1 53.97,48.77
$1N23793: length 16.3
  Top Layer w0.254: RLY4.4 44.19,32.8 R16.2 43.31,35.67 42.1,35.67 41.59,36.18 41.59,41.77 41.85,42.02 ; 41.85,42.02 D4.2 ; 41.85,42.02 42.82,42.02 Q4.3
$1N23794: length 3.4
  Top Layer w0.254: Q4.1 42.23,38.41 R15.2 R14.1
$1N23798: length 2
  Top Layer w0.254: LED5.1 R16.1
$1N24302: length 16.3
  Top Layer w0.254: 51.75,42.02 52.73,42.02 Q5.3 ; 51.75,42.02 51.5,41.77 51.5,36.18 52.01,35.67 53.22,35.67 R19.2 54.09,32.8 RLY5.4 ; 51.75,42.02 D5.2
$1N24303: length 3.4
  Top Layer w0.254: Q5.1 52.14,38.41 R18.2 53.97,38.22 R17.1
$1N24307: length 2
  Top Layer w0.254: LED6.1 R19.1
$1N24310: length 16.6
  Top Layer w0.254: 61.92,42.02 61.66,41.76 61.66,36.17 62.42,35.41 63.64,35.41 R22.2 64.51,33.05 RLY6.4 ; 61.92,42.02 62.88,42.02 Q6.3 ; 61.92,42.02 D6.2
$1N24311: length 3.4
  Top Layer w0.254: R20.1 R21.2 62.3,38.41 Q6.1
$1N24315: length 2.2
  Top Layer w0.254: LED7.1 R22.1
$1N26257: length 3.2
  Top Layer w0.254: OP2.1 33.87,53.83 R23.2
$1N26258: length 16.6
  Top Layer w0.254: 34.31,50.32 36.25,48.39 CN4.3 ; 34.31,50.32 R24.1 ; 34.31,50.32 35.33,51.33 35.33,52.86 34.82,53.37 33.55,53.37 32.28,52.1 30.44,52.1 OP2.2
$1N26259: length 2.2
  Top Layer w0.254: LED8.1 34.29,48.83

## Copper pours and planes (outline as drawn; the poured copper is in the pictures)
GND on Top Layer: 105.41,0 105.41,55.88 0,55.88 0,25.4 71.88,25.4 71.88,0
GND on Bottom Layer: 105.41,0 105.41,55.88 0,55.88 0,25.4 71.88,25.4 71.88,0

Small or netless copper shapes (teardrops, artwork), in the pictures only: 159 on Top Layer, 10 on Bottom Layer

## Text on the board
Top Silkscreen Layer: GND | VCC | Water flow sensor | Workshop Keypad | Irrigation Master | Irrigation Zone 1 | Irrigation Zone 2 | Irrigation Zone 3 | Input sensors | 2 | COM | 1 | JLCJLCJLCJLC | NO
